# EAGLE design KN-CON (EAGLE 5.06)
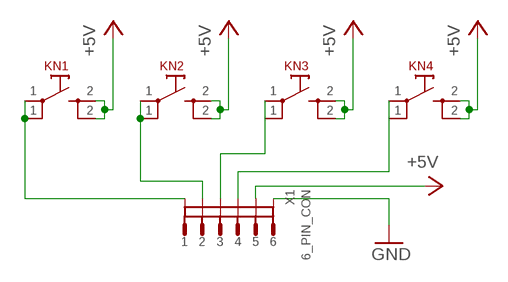
[diagram p0: schematic, sheet 1]

## Parts
KN1  LZQ-KN  [LZQ-KN]
KN2  LZQ-KN  [LZQ-KN]
KN3  LZQ-KN  [LZQ-KN]
KN4  LZQ-KN  [LZQ-KN]
X1  6_PIN_CON  [6_IN_PINS]

## Nets
+5V: KN1.3 KN1.4 KN2.3 KN2.4 KN3.3 KN3.4 KN4.3 KN4.4 X1.P$5
GND: X1.P$6
N$1: KN1.1 KN1.2 X1.P$1
N$2: KN2.1 KN2.2 X1.P$2
N$5: KN3.1 KN3.2 X1.P$3
N$6: KN4.1 KN4.2 X1.P$4

## Library data of the parts
KN1-KN4 = Dmitry:LZQ-KN
X1 = Dmitry:6_PIN_CON

## Board
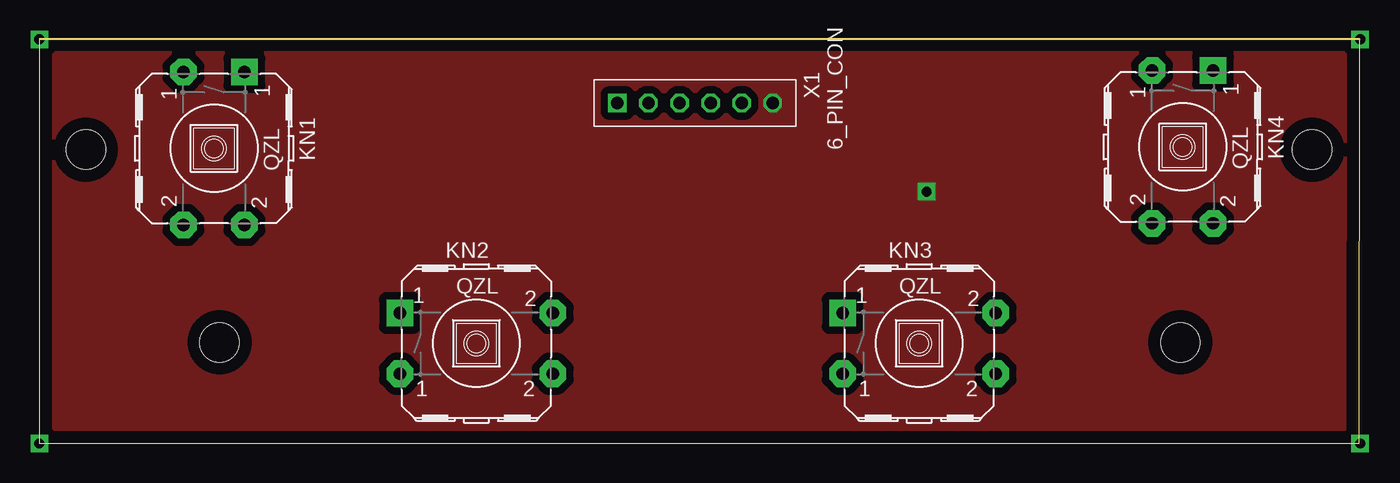
[diagram p1: board, top side]
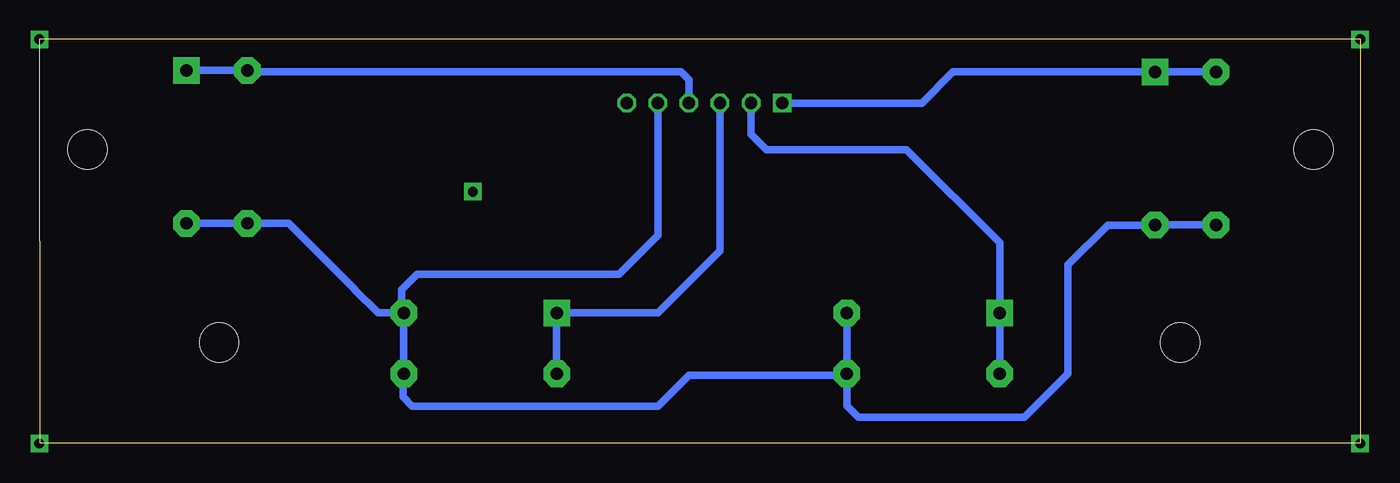
[diagram p2: board, bottom side, seen from below]

Size 107.93 x 33.07 mm. Coordinates in mm from the lower left corner, seen from the top.
Outline: 0,0 107.89,0.01 107.93,33.07 0,33.07 0,0
Copper layers (1*16): Top 0.035mm / dielectric 1.5mm / Bottom 0.035mm
Design rules "DMITRY": minimum track width 10mil, minimum drill 24mil, track to track 8mil, track to pad 8mil, pad to pad 8mil, via to via 8mil, smd to smd 8mil, copper to edge 40mil, drill to drill 8mil, minimum pad ring 10mil, minimum via ring 8mil, stop-mask expansion 4mil, vias tented up to drill 0mil, thermal gap 10mil
Holes 3.2 mm at 3.81,24 14.73,8.25 104.01,24 93.24,8.25

### Footprints (pad centres in the part's own frame; a part is rotated, then mirrored left to right if it is on the bottom)
LZQ-KN = drill 1 pad 2.184 square: 1 -7.62,2.54 | drill 1 pad 2.184 octagon: 2 -7.62,-2.438; 3 4.877,-2.438; 4 4.877,2.54
6_IN_PINS = drill 1 pad 1.422 square: P$1 -6.35,-1.27 | drill 1 pad 1.422 octagon: P$2 -3.81,-1.27; P$3 -1.27,-1.27; P$4 1.27,-1.27; P$5 3.81,-1.27; P$6 6.35,-1.27

### Placement (x,y rotation side)
KN1  14.22,22.73 270 top
KN2  37.08,8.13 0 top
KN3  73.28,8.13 0 top
KN4  93.39,22.86 270 top
X1  53.59,29.08 0 top

### Tracks (layer width: path | path; a pad name or v marks a point on that pad's centre or on a via)
+5V
  Bottom 0.61: KN1.3 KN1.4 16.79,17.83 20.63,17.83 23.88,14.58 23.88,5.71 27.43,2.16 41.02,2.16 41.96,3.1 41.96,7.87 | KN3.4 KN3.3 78.23,5.61 78.23,3.81 77.47,3.05 57.4,3.05 54.86,5.59 42.16,5.59 41.96,5.79 41.96,7.87 | 92.07,17.98 KN4.3 | 92.07,17.98 KN4.4 | 41.96,7.87 KN2.3 | X1.P$5 57.4,17.02 60.58,13.84 77.09,13.84 78.36,12.57 78.36,10.87 KN3.4 | 41.96,7.87 KN2.4 | KN3.4 80.26,10.67 82.17,12.57 82.17,12.6 87.56,17.99 92.07,17.99 92.07,17.98
GND  (via drill 0.8 pad 1.42)
  other vias: 72.52,20.57
  pour Top (isolate 0.61, no thermals): -0.51,33.02 -0.51,0 107.95,-0.13 107.95,32.89
N$1
  Bottom 0.61: KN1.2 KN1.1 33.27,30.35 35.81,27.81 X1.P$1
N$2
  Bottom 0.61: KN2.2 KN2.1 29.46,16.38 37.08,24 48.51,24 49.78,25.27 X1.P$2
N$5
  Bottom 0.61: KN3.2 KN3.1 57.4,10.67 52.32,15.75 X1.P$3
N$6
  Bottom 0.61: KN4.1 KN4.2 90.82,30.35 55.5,30.35 54.86,29.72 X1.P$4
N$15  (via drill 0.8 pad 1.42)  (1 unrouted)
  other vias: 0,33.02 107.95,33.02
N$16  (via drill 0.8 pad 1.42)
  other vias: 0,0
N$18  (via drill 0.8 pad 1.42)
  other vias: 107.95,0